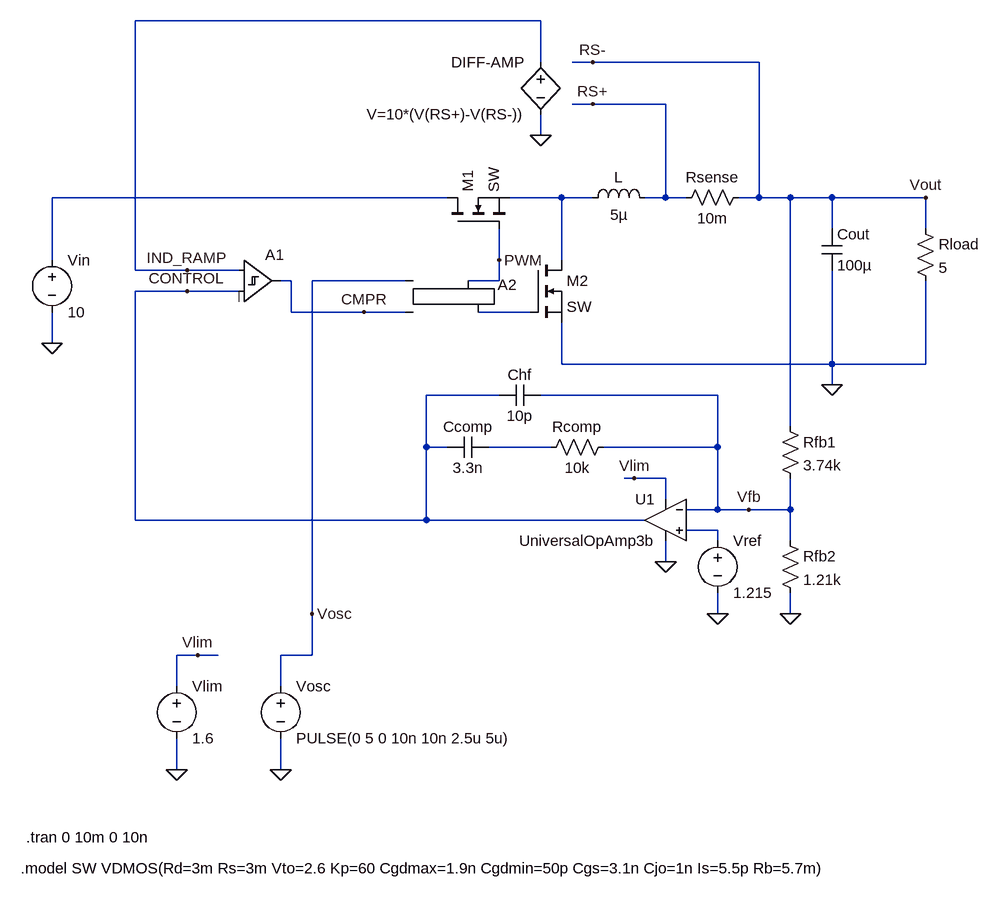
[diagram p0: schematic Current-Mode-Controlled Buck Converter.asc]
Current-Mode-Controlled Buck Converter.asc, the LTspice schematic file:
Version 4
SHEET 1 1108 1176
WIRE 0 -176 -624 -176
WIRE 0 -112 0 -176
WIRE 80 -112 48 -112
WIRE 336 -112 80 -112
WIRE 80 -48 48 -48
WIRE 192 -48 80 -48
WIRE 0 0 0 -32
WIRE -144 96 -752 96
WIRE 32 96 -48 96
WIRE 80 96 32 96
WIRE 192 96 192 -48
WIRE 192 96 160 96
WIRE 224 96 192 96
WIRE 336 96 336 -112
WIRE 336 96 304 96
WIRE 384 96 336 96
WIRE 448 96 384 96
WIRE 592 96 448 96
WIRE 448 144 448 96
WIRE 592 144 592 96
WIRE -752 192 -752 96
WIRE -64 192 -64 144
WIRE 32 192 32 96
WIRE -624 208 -624 -176
WIRE -544 208 -624 208
WIRE -464 208 -544 208
WIRE -384 224 -400 224
WIRE -208 224 -352 224
WIRE -64 224 -64 192
WIRE -64 224 -112 224
WIRE -544 240 -624 240
WIRE -464 240 -544 240
WIRE -384 272 -384 224
WIRE -272 272 -384 272
WIRE -208 272 -272 272
WIRE -16 272 -96 272
WIRE -752 320 -752 272
WIRE 32 352 32 288
WIRE 448 352 448 208
WIRE 448 352 32 352
WIRE 592 352 592 224
WIRE 592 352 448 352
WIRE 448 384 448 352
WIRE -64 400 -176 400
WIRE 272 400 0 400
WIRE 384 448 384 96
WIRE -176 480 -176 400
WIRE -144 480 -176 480
WIRE 16 480 -80 480
WIRE 272 480 272 400
WIRE 272 480 96 480
WIRE 144 528 128 528
WIRE 192 528 144 528
WIRE 192 560 192 528
WIRE 272 576 272 480
WIRE 272 576 224 576
WIRE 320 576 272 576
WIRE 384 576 384 528
WIRE 384 576 320 576
WIRE -624 592 -624 240
WIRE -176 592 -176 480
WIRE -176 592 -624 592
WIRE 160 592 -176 592
WIRE 272 608 224 608
WIRE 272 624 272 608
WIRE 384 624 384 576
WIRE 192 656 192 624
WIRE -352 736 -352 224
WIRE 272 736 272 704
WIRE 384 736 384 704
WIRE -528 800 -560 800
WIRE -496 800 -528 800
WIRE -352 800 -352 736
WIRE -352 800 -400 800
WIRE -560 848 -560 800
WIRE -400 848 -400 800
WIRE -560 976 -560 928
WIRE -400 976 -400 928
FLAG -752 320 0
FLAG 592 96 Vout
FLAG 0 0 0
FLAG -544 208 IND_RAMP
FLAG -64 192 PWM
FLAG 80 -112 RS-
FLAG 80 -48 RS+
FLAG 448 384 0
FLAG 384 736 0
FLAG 272 736 0
FLAG 144 528 Vlim
FLAG 192 656 0
FLAG -544 240 CONTROL
FLAG -560 976 0
FLAG -400 976 0
FLAG 320 576 Vfb
FLAG -352 736 Vosc
FLAG -528 800 Vlim
FLAG -272 272 CMPR
SYMBOL voltage -752 176 R0
WINDOW 123 0 0 Left 0
WINDOW 39 0 0 Left 0
SYMATTR InstName Vin
SYMATTR Value 10
SYMBOL ind 64 112 R270
WINDOW 0 32 56 VTop 2
WINDOW 3 5 56 VBottom 2
SYMATTR InstName L
SYMATTR Value 5µ
SYMBOL cap 432 144 R0
SYMATTR InstName Cout
SYMATTR Value 100µ
SYMATTR SpiceLine Rser=1m
SYMBOL res 576 128 R0
SYMATTR InstName Rload
SYMATTR Value 5
SYMBOL nmos -144 144 R270
SYMATTR InstName M1
SYMATTR Value SW
SYMBOL Digital\\diffschmtbuf -464 160 R0
SYMATTR InstName A1
SYMBOL Digital\\srflop -160 176 R0
SYMATTR InstName A2
SYMATTR SpiceLine Vhigh=15 Vlow=0 Ref=2.5
SYMBOL nmos -16 192 R0
SYMATTR InstName M2
SYMATTR Value SW
SYMBOL res 320 80 R90
WINDOW 0 0 56 VBottom 2
WINDOW 3 32 56 VTop 2
SYMATTR InstName Rsense
SYMATTR Value 10m
SYMBOL res 368 432 R0
SYMATTR InstName Rfb1
SYMATTR Value 3.74k
SYMBOL res 368 608 R0
SYMATTR InstName Rfb2
SYMATTR Value 1.21k
SYMBOL voltage 272 608 R0
WINDOW 123 0 0 Left 0
WINDOW 39 0 0 Left 0
SYMATTR InstName Vref
SYMATTR Value 1.215
SYMBOL cap 0 384 R90
WINDOW 0 0 32 VBottom 2
WINDOW 3 32 32 VTop 2
SYMATTR InstName Chf
SYMATTR Value 10p
SYMBOL cap -80 464 R90
WINDOW 0 0 32 VBottom 2
WINDOW 3 32 32 VTop 2
SYMATTR InstName Ccomp
SYMATTR Value 3.3n
SYMBOL res 112 464 R90
WINDOW 0 0 56 VBottom 2
WINDOW 3 32 56 VTop 2
SYMATTR InstName Rcomp
SYMATTR Value 10k
SYMBOL voltage -560 832 R0
WINDOW 123 0 0 Left 0
WINDOW 39 0 0 Left 0
SYMATTR InstName Vlim
SYMATTR Value 1.6
SYMBOL voltage -400 832 R0
WINDOW 123 0 0 Left 0
WINDOW 39 0 0 Left 0
SYMATTR InstName Vosc
SYMATTR Value PULSE(0 5 0 10n 10n 2.5u 5u)
SYMBOL OpAmps\\UniversalOpAmp3b 192 592 M0
SYMATTR InstName U1
SYMBOL bv 0 -128 M0
SYMATTR InstName DIFF-AMP
SYMATTR Value V=10*(V(RS+)-V(RS-))
TEXT -792 1080 Left 2 !.tran 0 10m 0 10n
TEXT -800 1128 Left 2 !.model SW VDMOS(Rd=3m Rs=3m Vto=2.6 Kp=60 Cgdmax=1.9n Cgdmin=50p Cgs=3.1n Cjo=1n Is=5.5p Rb=5.7m)

The netlist it stands for:
* Current-Mode-Controlled Buck Converter.asc
Vin N001 0 10
L N002 RS+ 5µ
Cout RS- 0 100µ Rser=1m
Rload RS- 0 5
M1 N001 PWM N002 N002 SW
A1 IND_RAMP CONTROL 0 0 0 0 CMPR 0 SCHMITT
A2 Vosc CMPR 0 0 0 N003 PWM 0 SRFLOP Vhigh=15 Vlow=0 Ref=2.5
M2 N002 N003 0 0 SW
Rsense RS- RS+ 10m
Rfb1 RS- Vfb 3.74k
Rfb2 Vfb 0 1.21k
Vref N005 0 1.215
Chf Vfb CONTROL 10p
Ccomp N004 CONTROL 3.3n
Rcomp Vfb N004 10k
Vlim Vlim 0 1.6
Vosc Vosc 0 PULSE(0 5 0 10n 10n 2.5u 5u)
* U1: UniversalOpAmp3b (symbol OpAmps\UniversalOpAmp3b not available, pins judged from their places): In+=N005 In-=Vfb V+=Vlim V-=0 OUT=CONTROL
B§DIFF-AMP IND_RAMP 0 V=10*(V(RS+)-V(RS-))
.model NMOS NMOS
.model PMOS PMOS
.lib standard.mos
.tran 0 10m 0 10n
.model SW VDMOS(Rd=3m Rs=3m Vto=2.6 Kp=60 Cgdmax=1.9n Cgdmin=50p Cgs=3.1n Cjo=1n Is=5.5p Rb=5.7m)
.backanno
.end